# EAGLE design tiltGame (EAGLE 6.5.0)
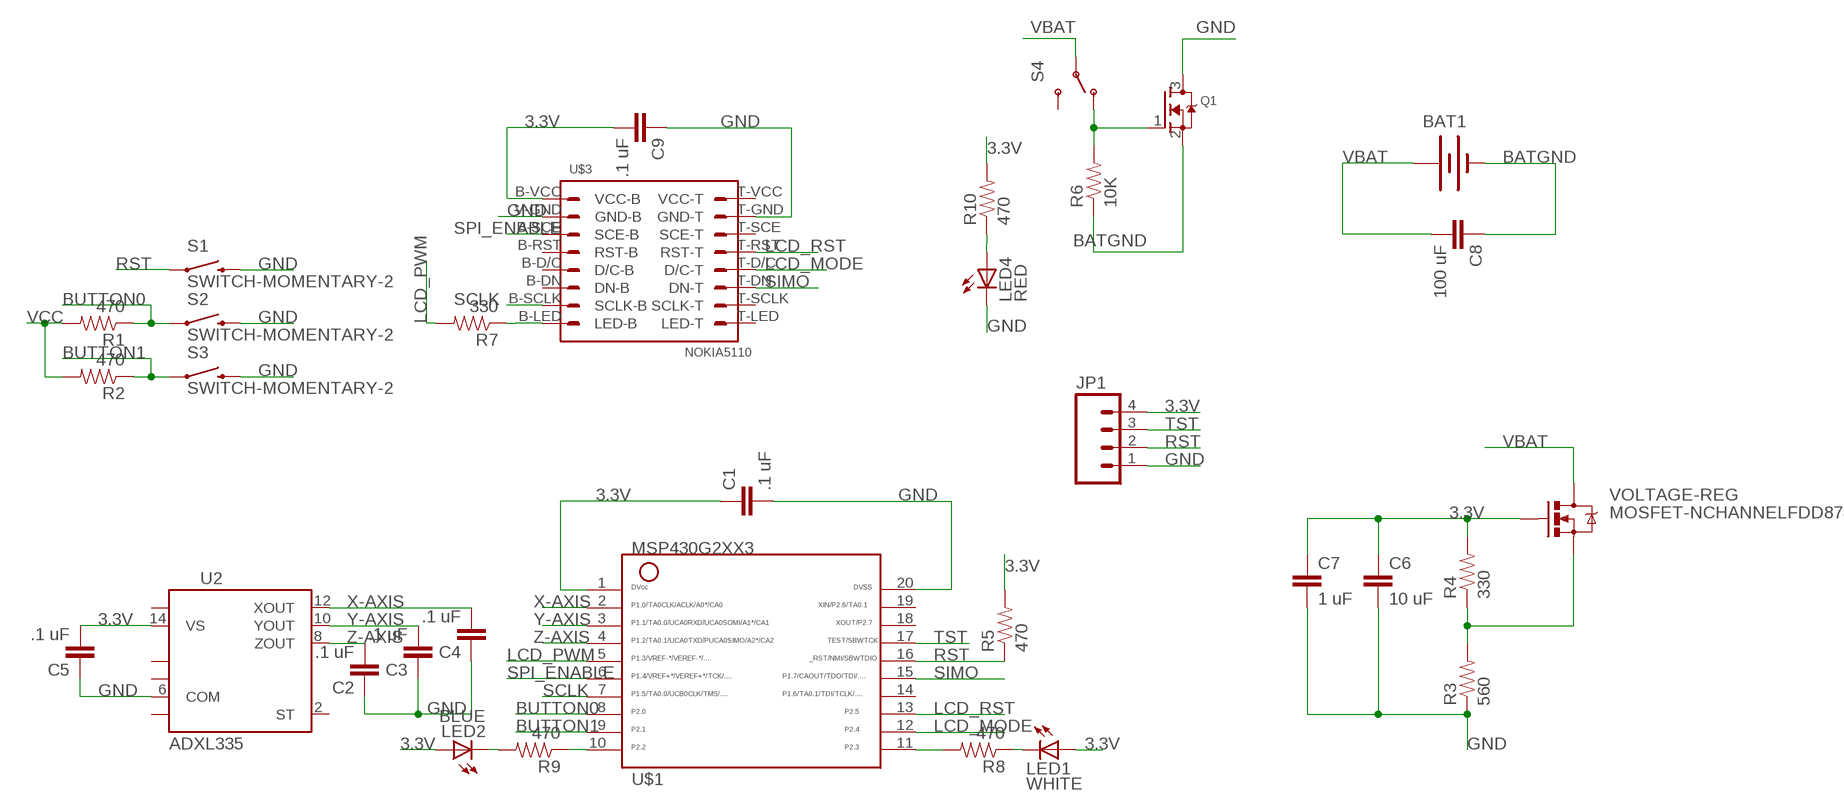
[diagram p0: schematic, sheet 1]

## Parts
BAT1  BATTERY9V  [BATTCON_9V]
C1  .1 uF  CAP0805  [0805]
C2  .1 uF  CAP0805  [0805]
C3  .1 uF  CAP0805  [0805]
C4  .1 uF  CAP0805  [0805]
C5  .1 uF  CAP0805  [0805]
C6  10 uF  CAP0805  [0805]
C7  1 uF  CAP0805  [0805]
C8  100 uF  CAP0805  [0805]
C9  .1 uF  CAP0805  [0805]
JP1  M041X04_NO_SILK  [1X04_NO_SILK]
LED1  WHITE  LED1206  [LED-1206]
LED2  BLUE  LED1206  [LED-1206]
LED4  RED  LED1206  [LED-1206]
Q1  MOSFET-NWAVE  [SOT23-W]
R1  470  RESISTOR0805-RES  [0805]
R2  470  RESISTOR0805-RES  [0805]
R3  560  RESISTOR0805-RES  [0805]
R4  330  RESISTOR0805-RES  [0805]
R5  470  RESISTOR0805-RES  [0805]
R6  10K  RESISTOR0805-RES  [0805]
R7  330  RESISTOR0805-RES  [0805]
R8  470  RESISTOR0805-RES  [0805]
R9  470  RESISTOR0805-RES  [0805]
R10  470  RESISTOR0805-RES  [0805]
S1  SWITCH-MOMENTARY-2  [TACTILE_PANISONIC]
S2  SWITCH-MOMENTARY-2  [TACTILE_PANISONIC]
S3  SWITCH-MOMENTARY-2  [TACTILE_PANISONIC]
S4  SWITCH-SPDTPTH  [SWITCH-SPDT]
U2  ADXL335  [LFCSP-16]
U$1  MSP430G2XX3TSSOP  [PW20]
U$3  NOKIA5110  [NOKIA5110]
VOLTAGE-REG  MOSFET-NCHANNELFDD8780  [DPAK]

## Nets
3.3V: C1.1 C5.2 C6.1 C7.1 C9.2 JP1.4 LED1.A LED2.A R4.2 R5.2 R10.2 U2.14(VS) U$1.1 U$3.B-VCC(VCC-B) VOLTAGE-REG.3(G-3)
BATGND: BAT1.- C8.1 Q1.2(S) R6.1
BUTTON0: R1.1 S2.1 U$1.8
BUTTON1: R2.1 S3.1 U$1.9
GND: C1.2 C2.1 C3.1 C4.1 C5.1 C6.2 C7.2 C9.1 JP1.1 LED4.C Q1.3(D) R3.1 S1.2 S2.2 S3.2 U2.6(COM) U$1.20 U$3.T-GND(GND-T) U$3.V-GND(GND-B)
LCD_MODE: U$1.12 U$3.T-D/C(D/C-T)
LCD_PWM: R7.2 U$1.5
LCD_RST: U$1.13 U$3.T-RST(RST-T)
N$1: R3.2 R4.1 VOLTAGE-REG.1(S-1)
N$2: R7.1 U$3.B-LED(LED-B)
N$3: R9.1 U$1.10
N$5: R8.2 U$1.11
N$6: LED4.A R10.1
N$7: LED1.C R8.1
N$8: LED2.C R9.2
N$10: Q1.1(G) R6.2 S4.1(O)
RST: JP1.2 R5.1 S1.1 U$1.16
SCLK: U$1.7 U$3.B-SCLK(SCLK-B)
SIMO: U$1.15 U$3.T-DN(DN-T)
SPI_ENABLE: U$1.6 U$3.B-SCE(SCE-B)
TST: JP1.3 U$1.17
VBAT: BAT1.+ C8.2 S4.2(P) VOLTAGE-REG.2(D-2)
VCC: R1.2 R2.2
X-AXIS: C4.2 U2.12(XOUT) U$1.2
Y-AXIS: C3.2 U2.10(YOUT) U$1.3
Z-AXIS: C2.2 U2.8(ZOUT) U$1.4
Unconnected: S4.3(S) U2.2(ST) U2.3(COM) U2.5(COM) U2.7(COM) U2.15(VS) U$1.14 U$1.18 U$1.19 U$3.B-D/C(D/C-B) U$3.B-DN(DN-B) U$3.B-RST(RST-B) U$3.T-LED(LED-T) U$3.T-SCE(SCE-T) U$3.T-SCLK(SCLK-T) U$3.T-VCC(VCC-T)

## Library data of the parts
BAT1 = tiltGame:BATTERY: Battery Holders Various common sizes : AA, AAA, 20mm coin cell and 12mm coin cell. 20MM_4LEGS, BATT-10373
C1-C9 = tiltGame:CAP: Capacitor Standard 0603 ceramic capacitor, and 0.1" leaded capacitor.
JP1 = tiltGame:M04: Header 4 Standard 4-pin 0.1" header. Use with straight break away headers (SKU : PRT-00116), right angle break away headers (PRT-00553), swiss pins (PRT-00743), machine pins (PRT-00117), and female headers (PRT-00115). Molex polarized connector foot print use with SKU : PRT-08231 with associated crimp pins and housings. 1MM SMD Version SKU: PRT-10208
LED1 LED2 LED4 = tiltGame:LED: LEDs Standard schematic elements and footprints for 5mm, 3mm, 1206, and 0603 sized LEDs. 5mm - Spark Fun Electronics SKU : COM-00529 (and others)
Q1 = tiltGame:MOSFET-N: N-Channel Mosfet 2N7002E - 60V 260mA SOT23 [Digikey: 2N7002ET1GOSTR-ND] - REEL BSH103 - 30V 850mA SOT23 [Digikey: 568-5013-1-ND]
R1-R10 = tiltGame:RESISTOR: Resistor Basic schematic elements and footprints for 0603, 1206, and PTH resistors.
S1-S3 = tiltGame:SWITCH-MOMENTARY-2: Various NO switches- pushbuttons, reed, etc
S4 = tiltGame:SWITCH-SPDT: SPDT Switch Simple slide switch, Spark Fun Electronics SKU : COM-00102 DPDT SMT slide switch, AYZ0202, SWCH-08179
U2 = tiltGame:ADXL335: 3-axis, 3g accelerometer, analog out
U$1 = tiltGame:MSP430G2XX3: MSP430G2XX3 PDIP (N) 20 Pin Package
U$3 = tiltGame:NOKIA5110
VOLTAGE-REG = tiltGame:MOSFET-NCHANNEL: Common NMOSFET Parts MFG P/N Store ID Prod ID FDD8780 TRANS-09984 SI7820DN TRANS-11055 FDS6630A IC-08089 2N7002PW TRANS-11151 FQP30N06L COM-10213 TRANS-10060 BSS123LT1G TRANS-08345 BSS138 TRANS-00830 BS170 2N7000; PROD_ID: TRANS-09984

## Board
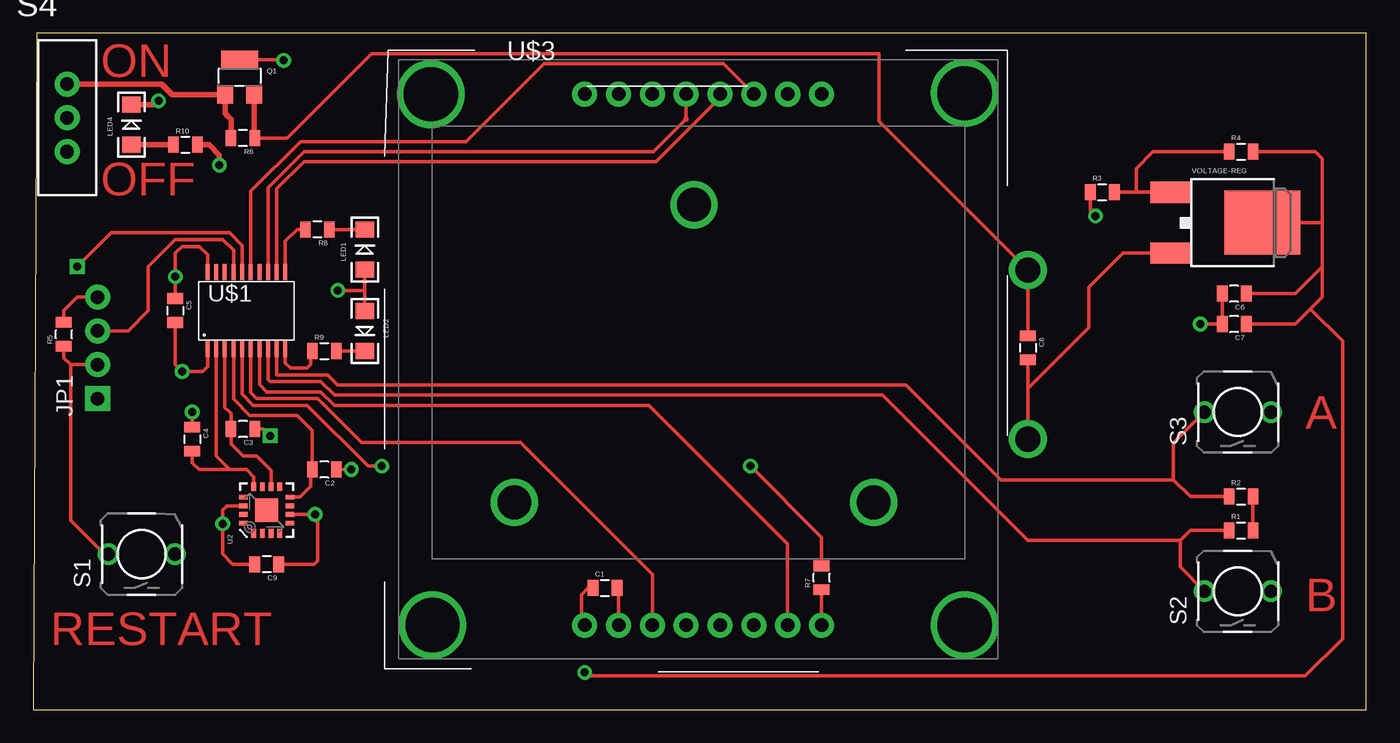
[diagram p1: board, top side]
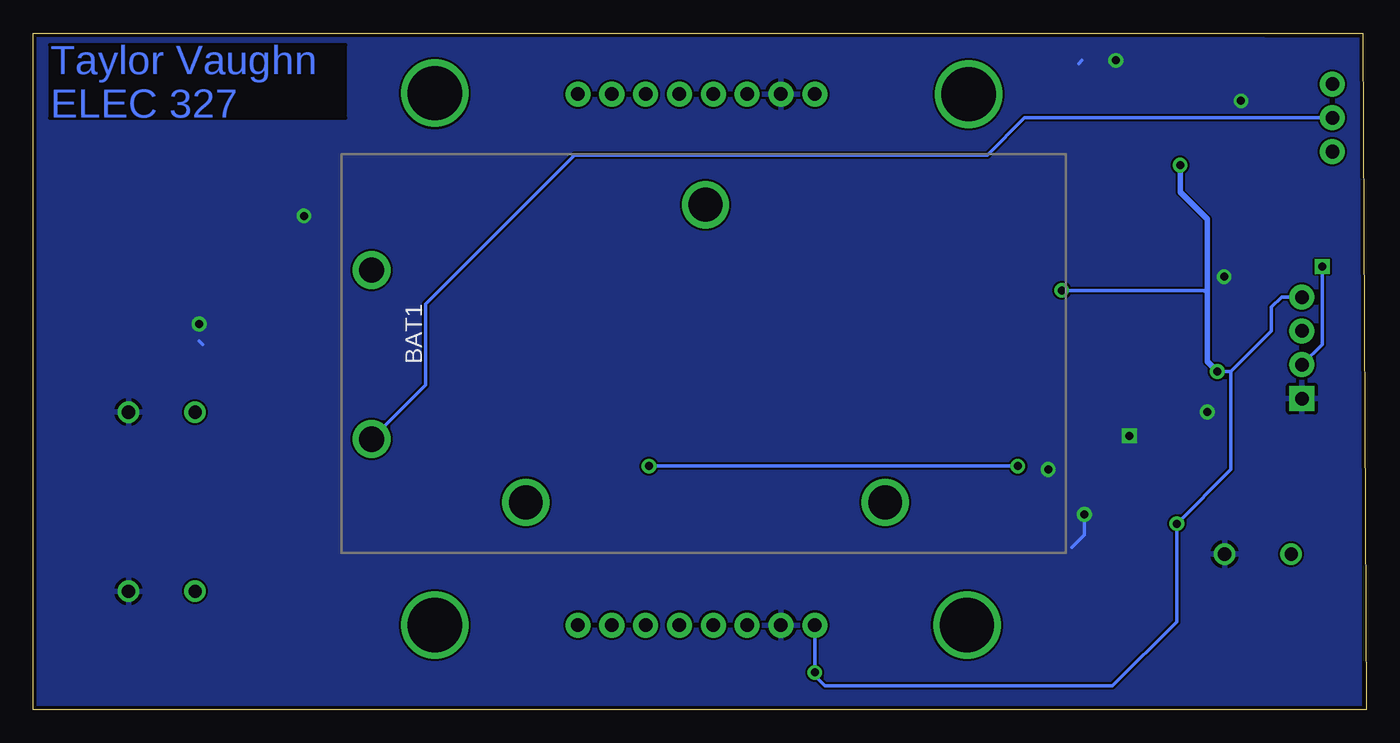
[diagram p2: board, bottom side, seen from below]

Size 100.08 x 50.8 mm. Coordinates in mm from the lower left corner, seen from the top.
Outline: 0,0 100.08,0 100.08,50.8 0.25,50.8 0,0
Copper layers (1*16): Top 0.035mm / dielectric 1.5mm / Bottom 0.035mm
Design rules "AdvancedCircuitsBarebones": minimum track width 6mil, minimum drill 20mil, track to track 6mil, track to pad 6mil, pad to pad 6mil, via to via 6mil, smd to smd 6mil, copper to edge 10mil, drill to drill 6mil, minimum pad ring 12mil, minimum via ring 10mil, stop-mask expansion 4mil, vias tented up to drill 25mil, thermal gap 10mil

### Footprints (pad centres in the part's own frame; a part is rotated, then mirrored left to right if it is on the bottom)
BATTCON_9V = drill 1.905: + 0,0; - 0,-12.7 | drill 2.54: P$1 -38.557,4.75; P$4 -11.582,4.75; P$5 -25.07,-17.602
0805 = smd 0.8 x 1.2: 1 -0.9,0; 2 0.9,0
1X04_NO_SILK = drill 1.016 pad 1.88 square: 1 0,0 | drill 1.016 pad 1.88: 2 2.54,0; 3 5.08,0; 4 7.62,0
LED-1206 = smd 1.2 x 1.4: A -1.5,0; C 1.5,0
SOT23-W = smd 1.2 x 1.4: 1 -1.1,-1.3; 2 1.1,-1.3 | smd 2.8 x 1.4: 3 0,1.3
TACTILE_PANISONIC = drill 1 pad 1.5: 1 0,2.5; 2 0,-2.5
SWITCH-SPDT = drill 1.016 pad 1.88: 1 0,2.54; 2 0,0; 3 0,-2.54
LFCSP-16 = smd 1.75 x 1.75: 0 0,0 | smd 0.65 x 0.37: 1 -1.75,0.975; 2 -1.75,0.325; 3 -1.75,-0.325; 4 -1.75,-0.975; 9 1.75,-0.975; 10 1.75,-0.325; 11 1.75,0.325; 12 1.75,0.975 | smd 0.37 x 0.65: 5 -0.975,-1.75; 6 -0.325,-1.75; 7 0.325,-1.75; 8 0.975,-1.75; 13 0.975,1.75; 14 0.325,1.75; 15 -0.325,1.75; 16 -0.975,1.75
PW20 = smd 0.3 x 1.2: 1 -2.925,-2.9; 2 -2.275,-2.9; 3 -1.625,-2.9; 4 -0.975,-2.9; 5 -0.325,-2.9; 6 0.325,-2.9; 7 0.975,-2.9; 8 1.625,-2.9; 9 2.275,-2.9; 10 2.925,-2.9; 11 2.925,2.9; 12 2.275,2.9; 13 1.625,2.9; 14 0.975,2.9; 15 0.325,2.9; 16 -0.325,2.9; 17 -0.975,2.9; 18 -1.625,2.9; 19 -2.275,2.9; 20 -2.925,2.9
NOKIA5110 = drill 1.016 pad 1.88: B-D/C 24.13,2.54; B-DN 26.67,2.54; B-LED 31.75,2.54; B-RST 21.59,2.54; B-SCE 19.05,2.54; B-SCLK 29.21,2.54; B-VCC 13.97,2.54; T-D/C 24.13,42.418; T-DN 26.67,42.418; T-GND 16.51,42.418; T-LED 31.75,42.418; T-RST 21.59,42.418; T-SCE 19.05,42.418; T-SCLK 29.21,42.418; T-VCC 13.97,42.418; V-GND 16.51,2.54 | drill 4.064: P$1 2.413,42.421; P$2 42.5,42.5; P$3 2.54,2.54; P$4 42.5,2.54
DPAK = smd 1.6 x 3: 1 -2.28,-5.31; 2 2.28,-5.31 | smd 4.826 x 5.715: 3 0,1.588

### Placement (x,y rotation side)
BAT1  74.68,20.32 180 bottom
C1  42.93,9.14 0 top
C2  21.84,18.03 180 top
C3  15.75,21.08 180 top
C4  11.94,20.32 270 top
C5  10.67,29.97 270 top
C6  90.17,31.24 180 top
C7  90.17,28.96 180 top
C8  74.68,27.18 270 top
C9  17.53,10.92 180 top
JP1  4.83,23.37 90 top
LED1  24.89,34.54 90 top
LED2  24.89,28.45 270 top
LED4  7.37,43.94 90 top
Q1  15.49,47.5 0 top
R1  90.68,13.46 0 top
R2  90.68,16 0 top
R3  80.26,38.86 0 top
R4  90.68,41.91 0 top
R5  2.29,28.19 90 top
R6  15.75,42.93 180 top
R7  59.18,9.91 90 top
R8  21.34,36.07 180 top
R9  21.84,26.92 0 top
R10  11.43,42.42 0 top
S1  8.13,11.68 90 top
S2  90.42,8.89 90 top
S3  90.42,22.35 90 top
S4  2.54,44.45 0 top
U2  17.53,14.99 90 top
U$1  16,29.97 0 top
U$3  27.43,3.81 0 top
VOLTAGE-REG  90.68,36.58 270 top

### Tracks (layer width: path | path; a pad name or v marks a point on that pad's centre or on a via)
3.3V  (via drill 0.6)
  Top 0.254: U$1.1 13.08,25.78 12.7,25.4 v11.18,25.4 10.67,25.91 C5.2 | JP1.4 3.3,30.99 2.29,29.97 R5.2 | C9.2 14.99,10.92 14.22,11.68 v14.22,13.97 14.22,14.99 14.55,15.31 U2.14 | R4.2 96.27,41.91 96.77,41.4 96.77,36.58 | C6.1 94.74,31.24 96.77,33.27 | 96.77,33.27 96.77,36.58 | 96.77,33.27 96.77,30.99 95.89,30.1 | VOLTAGE-REG.3 96.77,36.58 | C1.1 41.66,9.14 41.15,8.64 41.15,6.6 U$3.B-VCC | LED1.A 24.89,31.5 | LED2.A 24.89,31.5 | 24.89,31.5 v22.86,31.5 | C7.1 94.74,28.96 95.89,30.1 | v41.4,2.79 41.66,2.54 95.5,2.54 98.3,5.33 98.3,27.69 95.89,30.1
  Top 0.406: R10.2 13.21,42.42 13.97,41.66 v13.97,40.89
  Bottom 0.254: v11.18,25.4 10.16,25.4 | 10.16,25.4 7.11,28.45 7.11,30.23 6.35,30.99 JP1.4 | 10.16,25.4 10.16,18.03 v14.22,13.97 14.22,6.6 19.05,1.78 40.64,1.78 41.4,2.54 v41.4,2.79 U$3.B-VCC | v22.86,31.5 12.19,31.5 11.94,31.24
  Bottom 0.406: v13.97,40.89 13.97,38.86 11.94,36.83 11.94,31.24 11.94,26.16 v11.18,25.4
BATGND
  Top 0.254: C8.1 BAT1.- 63.5,44.2 63.5,49.28 25.4,49.28 19.05,42.93 R6.1
  Top 0.406: Q1.2 16.59,42.98 R6.1
BUTTON0
  Top 0.254: U$1.8 17.63,24.79 17.78,24.64 21.59,24.64 22.61,23.62 63.75,23.62 74.68,12.7 86.11,12.7 | R1.1 86.87,13.46 86.36,12.95 86.11,12.7 | 86.11,12.7 86.11,10.71 S2.1
BUTTON1
  Top 0.254: R2.1 86.87,16 85.6,17.27 | 85.6,17.27 85.6,20.03 S3.1 | U$1.9 18.28,25.16 18.29,25.15 22.1,25.15 22.86,24.38 65.53,24.38 72.64,17.27 85.6,17.27
GND  (via drill 0.6)
  Top 0.254: U$1.20 13.08,34.17 12.45,34.8 11.18,34.8 10.67,34.29 v10.67,32.51 C5.1 | C3.1 17.27,21.08 v17.78,20.57 | C9.1 21.08,10.92 21.34,11.18 21.34,14.48 v21.15,14.66 U2.6 | C2.1 v23.88,18.03 | Q1.3 18.77,48.8 v18.8,48.77 | C4.1 v11.94,22.35 | C6.2 C7.2 v87.63,28.96 | R3.1 79.36,37.48 v79.76,37.08 | U$3.V-GND 43.94,9.03 C1.2
  Top 0.406: LED4.C 9.17,45.44 v9.4,45.72
  Bottom 0.254: v21.15,14.66 21.15,13.14 22.1,12.19 | 21.34,48.77 21.59,48.51 | 87.63,27.69 87.38,27.43
  pour Bottom: 0.51,0.25 100.08,0 100.08,50.8 0.51,50.29
LCD_MODE
  Top 0.254: U$3.T-D/C 51.56,45.97 46.74,41.15 20.32,41.15 18.29,39.12 18.29,32.88 U$1.12
LCD_PWM  (via drill 0.6)
  Top 0.254: U$1.5 15.68,23.69 16.51,22.86 20.57,22.86 25.15,18.29 v26.16,18.29 | R7.2 59.18,12.95 v53.85,18.29
  Bottom 0.254: v53.85,18.29 v26.16,18.29
LCD_RST
  Top 0.254: U$1.13 17.63,39.22 20.32,41.91 46.58,41.91 49.02,44.35 U$3.T-RST
  Top 0.406: 49.01,44.35 49.02,44.35
N$1
  Top 0.254: VOLTAGE-REG.1 82.8,38.86 | 82.8,38.86 R3.2 | R4.1 84.07,41.91 82.8,40.64 82.8,38.86
N$2
  Top 0.254: U$3.B-LED R7.1
N$3
  Top 0.254: U$1.10 18.93,26.03 19.3,25.65 20.57,25.65 20.83,25.91 20.83,26.81 R9.1
N$5
  Top 0.254: U$1.11 18.93,35.18 19.81,36.07 R8.2
N$6
  Top 0.406: R10.1 7.39,42.42 LED4.A
N$7
  Top 0.254: R8.1 24.87,36.07 LED1.C
N$8
  Top 0.254: LED2.C 22.77,26.95 R9.2
N$10
  Top 0.406: S4.1 9.65,46.99 10.44,46.2 Q1.1 14.39,44.79 14.48,44.7 14.61,44.58 14.85,44.33 R6.2
RST  (via drill 0.6)
  Top 0.254: U$1.16 15.68,34.87 14.73,35.81 5.84,35.81 v3.3,33.27 | R5.1 2.29,26.42 2.79,25.91 | 2.79,25.91 JP1.2 | S1.1 5.33,11.68 2.79,14.22 2.79,25.91
  Bottom 0.254: v3.3,33.27 3.3,27.43 JP1.2
SCLK
  Top 0.254: U$3.B-SCLK 56.64,12.45 46.23,22.86 22.61,22.86 21.59,23.88 17.53,23.88 16.98,24.43 U$1.7
SIMO
  Top 0.254: U$1.15 16.33,38.93 20.07,42.67 32.51,42.67 38.35,48.51 51.82,48.51 U$3.T-DN
SPI_ENABLE
  Top 0.254: U$3.B-SCE 46.48,10.16 36.58,20.07 24.64,20.07 21.34,23.37 16.76,23.37 16.33,23.8 U$1.6
TST
  Top 0.254: U$1.17 15.03,34.5 14.22,35.31 10.67,35.31 8.64,33.27 8.64,29.97 7.11,28.45 JP1.3
VBAT
  Top 0.254: BAT1.+ 74.68,24.13 | 74.68,24.13 C8.2 | VOLTAGE-REG.2 81.79,34.3 79.25,31.75 79.25,28.7 74.68,24.13
  Bottom 0.254: S4.2 25.65,44.45 28.45,41.66 59.44,41.66 70.61,30.48 70.61,24.38 BAT1.+
VCC
  Top 0.254: R2.2 R1.2
X-AXIS
  Top 0.254: U2.12 16.55,17.48 16,18.03 14.99,18.03 14.73,18.03 | U$1.2 13.73,19.04 14.73,18.03 | C4.2 11.94,18.54 12.45,18.03 14.73,18.03
Y-AXIS
  Top 0.254: U2.10 17.85,17.96 16.76,19.05 15.75,19.05 14.85,19.95 C3.2 14.85,22.24 14.73,22.35 14.38,22.71 U$1.3
Z-AXIS
  Top 0.254: C2.2 20.94,17.9 20.83,17.78 | U2.8 20.02,15.96 20.83,16.76 20.83,17.92 C2.2 | C2.2 20.94,20.97 19.81,22.1 16.26,22.1 15.03,23.33 U$1.4

### Text on the board
Top: ON | OFF | A | B | RESTART
Bottom: Taylor Vaughn / ELEC 327